# EAGLE design Polsador  (EAGLE 6.4)
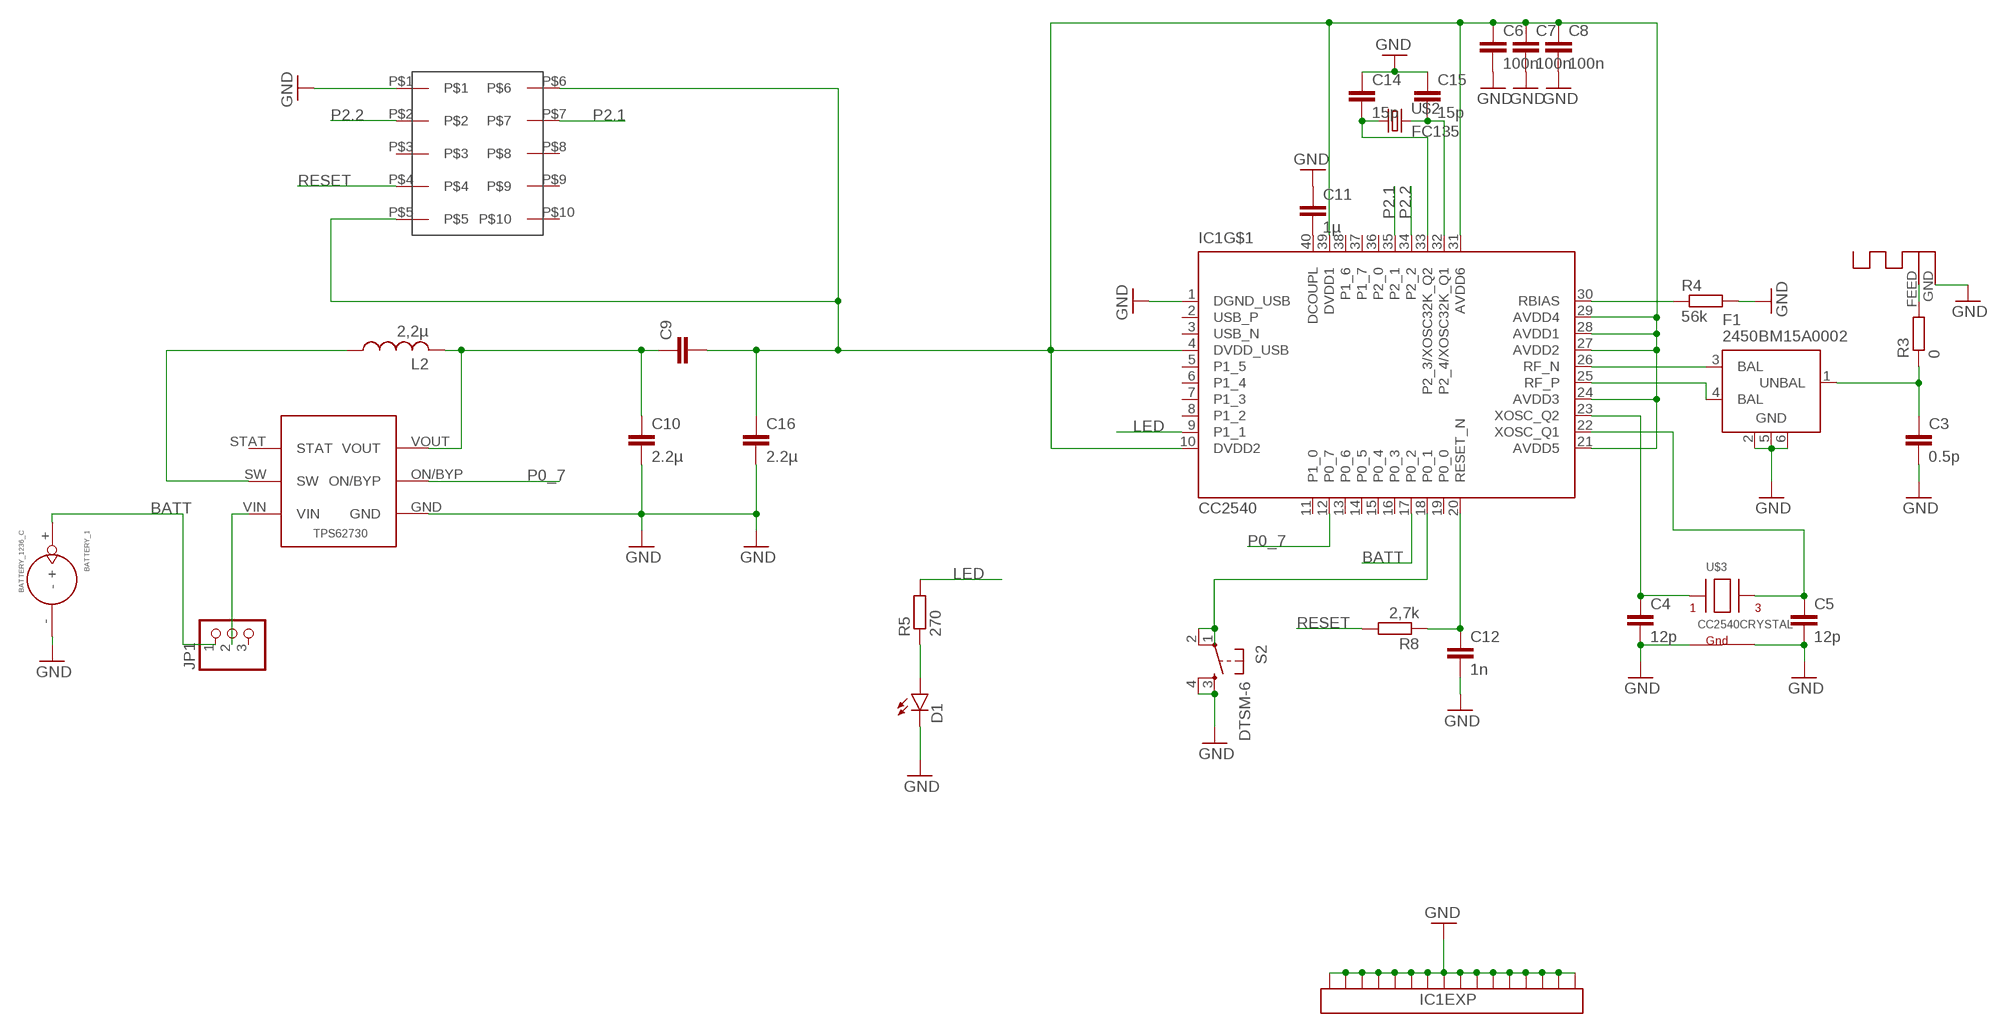
[diagram p0: schematic, sheet 1]

## Parts
ANT1  ANTENNA  [RN-ANT]
BATTERY_1  BATTERY_1236_C  [BATTERY_1236_C]
C3  0.5p  C-EUC0402K  [C0402K]
C4  12p  C-EUC0402K  [C0402K]
C5  12p  C-EUC0402K  [C0402K]
C6  100n  C-EUC0402K  [C0402K]
C7  100n  C-EUC0402K  [C0402K]
C8  100n  C-EUC0402K  [C0402K]
C9  C-EUC0402  [C0402]
C10  2.2µ  C-EUC0402K  [C0402K]
C11  1µ  C-EUC0402K  [C0402K]
C12  1n  C-EUC0402K  [C0402K]
C14  15p  C-EUC0402K  [C0402K]
C15  15p  C-EUC0402K  [C0402K]
C16  2.2µ  C-EUC0402K  [C0402K]
D1  LED0603  [LED-0603]
F1  2450BM15A0002  [2450BM15A0002]
IC1  CC2540  [QFN40-6X6]
JP1  PINHD-1X3  [1X03]
L2  2,2µ  L-USL2012C  [L2012C]
R3  0  R-EU_R0402  [R0402]
R4  56k  R-EU_R0402  [R0402]
R5  270  R-EU_R0402  [R0402]
R8  2,7k  R-EU_R0402  [R0402]
S2  DTSM-6  [DTSM-6]
U$1  DEBUG  [DEBUG]
U$2  FC135  [FC135]
U$3  CC2540CRYSTAL  [CC2540CRYSTAL]
U$4  TPS62730  [TPS62730]

## Nets
BATT: BATTERY_1.+ IC1.17(P0_2) JP1.1
GND: ANT1.GND BATTERY_1.- C3.2 C4.2 C5.2 C6.2 C7.2 C8.2 C10.2 C11.1 C12.2 C14.1 C15.1 C16.2 D1.C F1.2(GND) F1.5(GND) F1.6(GND) IC1.1(DGND_USB) IC1.EXP@1(EXP:EXP16) IC1.EXP@2(EXP:EXP16) IC1.EXP@3(EXP:EXP16) IC1.EXP@4(EXP:EXP16) IC1.EXP@5(EXP:EXP16) IC1.EXP@6(EXP:EXP16) IC1.EXP@7(EXP:EXP16) IC1.EXP@8(EXP:EXP16) IC1.EXP@9(EXP:EXP16) IC1.EXP@10(EXP:EXP16) IC1.EXP@11(EXP:EXP16) IC1.EXP@12(EXP:EXP16) IC1.EXP@13(EXP:EXP16) IC1.EXP@14(EXP:EXP16) IC1.EXP@15(EXP:EXP16) IC1.EXP@16(EXP:EXP16) R4.2 S2.3 S2.4 U$1.P$1 U$3.2(G1) U$3.4(G2) U$4.GND
LED: IC1.9(P1_1) R5.2
N$1: C14.2 IC1.33(P2_3/XOSC32K_Q2) U$2.1
N$2: C15.2 IC1.32(P2_4/XOSC32K_Q1) U$2.2
N$3: IC1.18(P0_1) S2.1 S2.2
N$5: L2.1 U$4.SW
N$6: C9.1 C10.1 L2.2 U$4.VOUT
N$7: C4.1 IC1.23(XOSC_Q2) U$3.1(X1)
N$8: F1.3(BAL) IC1.26(RF_N)
N$9: F1.4(BAL) IC1.25(RF_P)
N$10: C3.1 F1.1(UNBAL) R3.1
N$11: ANT1.FEED R3.2
N$12: C5.1 IC1.22(XOSC_Q1) U$3.3(X2)
N$13: IC1.30(RBIAS) R4.1
N$14: C11.2 IC1.40(DCOUPL)
N$15: C12.1 IC1.20(RESET_N) R8.1
N$16: C6.1 C7.1 C8.1 C9.2 C16.1 IC1.4(DVDD_USB) IC1.10(DVDD2) IC1.21(AVDD5) IC1.24(AVDD3) IC1.27(AVDD2) IC1.28(AVDD1) IC1.29(AVDD4) IC1.31(AVDD6) IC1.39(DVDD1) U$1.P$5 U$1.P$6
N$17: JP1.2 U$4.VIN
N$18: D1.A R5.1
P0_7: IC1.12(P0_7) U$4.ON/BYP
P2.1: IC1.35(P2_1) U$1.P$7
P2.2: IC1.34(P2_2) U$1.P$2
RESET: R8.2 U$1.P$4
Unconnected: IC1.2(USB_P) IC1.3(USB_N) IC1.5(P1_5) IC1.6(P1_4) IC1.7(P1_3) IC1.8(P1_2) IC1.11(P1_0) IC1.13(P0_6) IC1.14(P0_5) IC1.15(P0_4) IC1.16(P0_3) IC1.19(P0_0) IC1.36(P2_0) IC1.37(P1_7) IC1.38(P1_6) JP1.3 U$1.P$3 U$1.P$8 U$1.P$9 U$1.P$10 U$4.STAT

## Library data of the parts
ANT1 = adafruit:ANTENNA
BATTERY_1 = Itead_BP_110825.lbr:BATTERY_1236_C: SOC004
C3-C12 C14-C16 = rcl:C-EU: CAPACITOR, European symbol
D1 = SparkFun-LED:LED: LEDs Standard schematic elements and footprints for 5mm, 3mm, 1206, and 0603 sized LEDs. 5mm - Spark Fun Electronics SKU : COM-00529 (and others)
F1 = johanson-technology:2450BM15A0002: 2.45 GHz Impedance Matched Balun-Filter For TI CC253X/CC2540 Chipset family Data sheet <http://www.johansontechnology.com/images/stories/ip/baluns/balun_filter_combo_matched_2450bm15a0002_v8.pdf>
IC1 = texas:CC2540: 2.4-GHz Bluetooth® low energy System-on-Chip Auto generated by make-symbol-device-package-bsdl.ulp Rev. 39 Source: cc2540.txt
JP1 = pinhead:PINHD-1X3: PIN HEADER
L2 = rcl:L-US: INDUCTOR, American symbol
R3-R5 R8 = rcl:R-EU_: RESISTOR, European symbol
S2 = switch-tact:DTSM-6
U$1 = untitled:DEBUG
U$2 = crysta1l:FC135
U$3 = adafruit:CC2540CRYSTAL
U$4 = TI-TPS6273X:TPS62730: TPS62730: Step Down Converter with Bypass Mode for Ultra Low Power Wireless Applications The TPS62730 is a high frequency synchronous step down DC-DC converter optimized for ultra low power wireless applications. The device is optimized to supply TI&3146;s Low Power Wireless sub 1GHz and 2.4GHz RF transceivers and System-On-Chip-solutions. The TPS62730 reduces the current consumption drawn from the battery during TX and RX mode by a high efficient step down voltage conversion. It provides up to 100mA output current and allows the use of tiny and low cost chip inductors and capacitors. With an input voltage range of 1.9V to 3.9V the device supports Li-primary battery chemistries such as Li-SOCl2, Li-SO2, Li-MnO2 and also two cell alkaline batteries. The TPS62730 features an Ultra Low Power bypass mode with typical 30nA current consumption to support sleep and low power modes of TI’s CC2540 Low Energy and CC430 System-On-Chip solutions. In this bypass mode, the output capacitor of the DC/DC converter is connected via an integrated typ. 2.1Ω Bypass switch to the battery. In DC/DC operation mode the device provides a fixed output voltage to the system. With a switch frequency up to 3MHz, the TPS62730 features low output ripple voltage and low noise even with a small 2.2µF output capacitor. The automatic transition into bypass mode during DC/DC operation prevents an increase of output ripple voltage and noise once the DC/DC converter operates close to 100% duty cycle. The device automatically enters bypass mode once the battery voltage falls below the transition threshold VIT BYP. The TPS62730 is available in a 1 × 1.5mm2 6 pin QFN package.

## Board
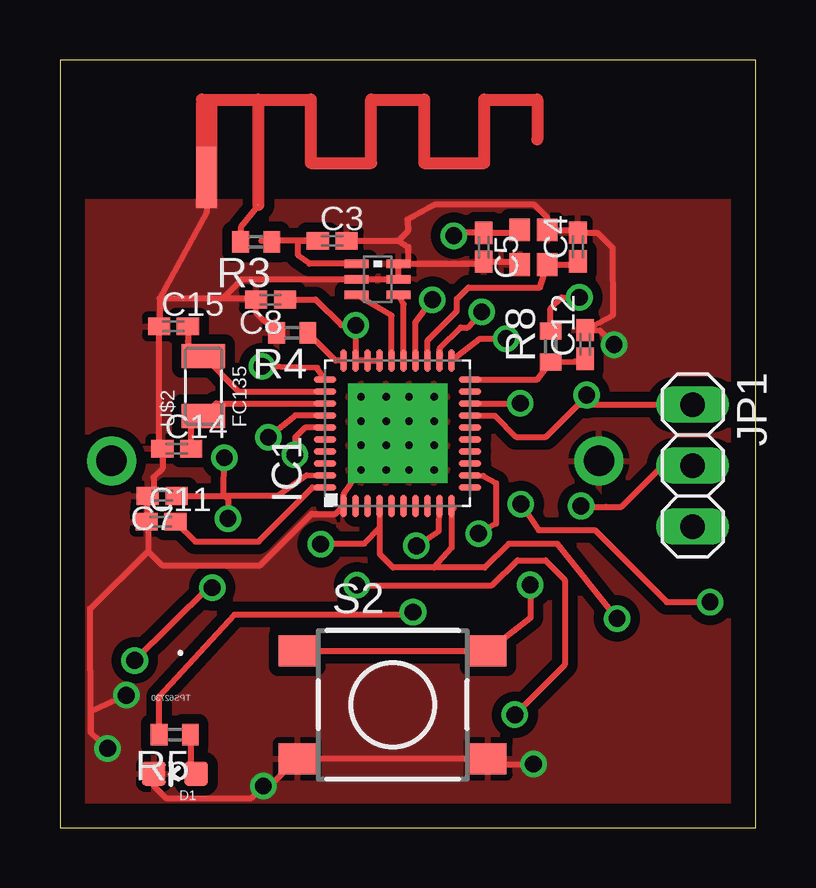
[diagram p1: board, top side]
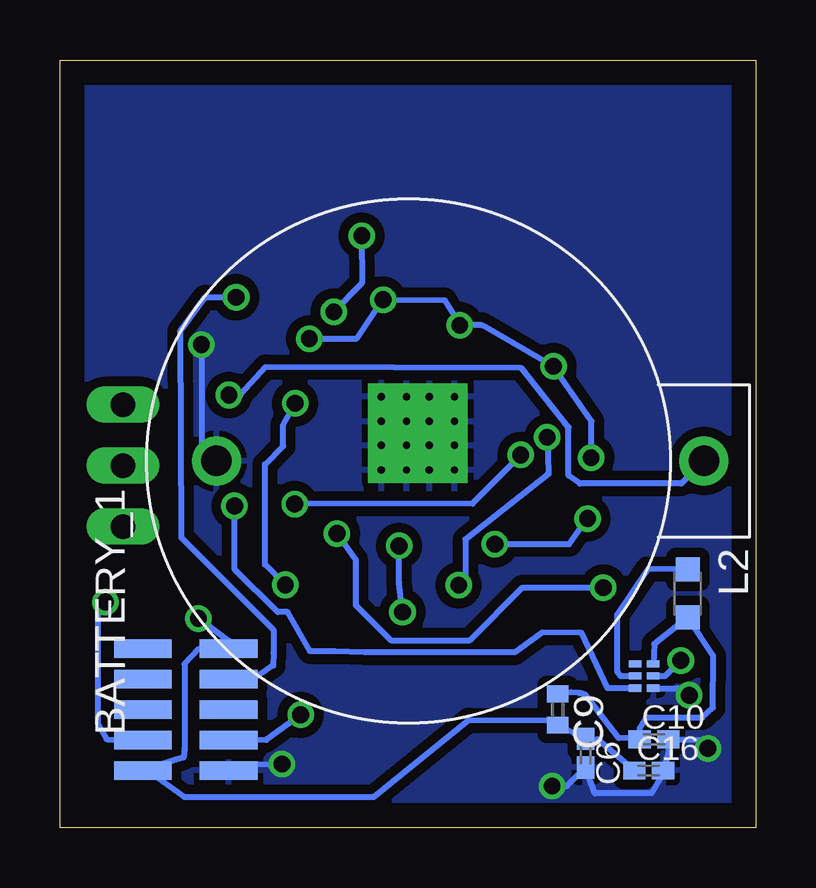
[diagram p2: board, bottom side, seen from below]

Size 29 x 32 mm. Coordinates in mm from the lower left corner, seen from the top.
Outline: 0,0 29,0 29,32 0,32 0,0
Copper layers (1*16): Top 0.035mm / dielectric 1.5mm / Bottom 0.035mm
Design rules "default": minimum track width 10mil, minimum drill 24mil, track to track 8mil, track to pad 8mil, pad to pad 8mil, via to via 8mil, smd to smd 8mil, copper to edge 40mil, drill to drill 8mil, minimum pad ring 10mil, minimum via ring 8mil, stop-mask expansion 4mil, vias tented up to drill 0mil, thermal gap 10mil

### Footprints (pad centres in the part's own frame; a part is rotated, then mirrored left to right if it is on the bottom)
RN-ANT = smd 0.025 x 0.025: FEED 0,2.159 | smd 2.54 x 0.889: GND -1.143,0
BATTERY_1236_C = drill 1.27 pad 2.032: + 0,0; - 0,20.32
C0402K = smd 0.925 x 0.74: 1 -0.6,0; 2 0.6,0
C0402 = smd 0.7 x 0.9: 1 -0.65,0; 2 0.65,0
LED-0603 = smd 1 x 1: A 0,-0.877; C 0,0.877
2450BM15A0002 = smd 0.35 x 1: 1 -0.65,-0.875; 2 0,-0.875; 3 0.65,-0.875; 4 0.65,0.875; 5 0,0.875; 6 -0.65,0.875
QFN40-6X6 = smd 0.95 x 0.28: 1 -3.025,2.25; 2 -3.025,1.75; 3 -3.025,1.25; 4 -3.025,0.75; 5 -3.025,0.25; 6 -3.025,-0.25; 7 -3.025,-0.75; 8 -3.025,-1.25; 9 -3.025,-1.75; 10 -3.025,-2.25; 21 3.025,-2.25; 22 3.025,-1.75; 23 3.025,-1.25; 24 3.025,-0.75; 25 3.025,-0.25; 26 3.025,0.25; 27 3.025,0.75; 28 3.025,1.25; 29 3.025,1.75; 30 3.025,2.25 | smd 0.28 x 0.95: 11 -2.25,-3.025; 12 -1.75,-3.025; 13 -1.25,-3.025; 14 -0.75,-3.025; 15 -0.25,-3.025; 16 0.25,-3.025; 17 0.75,-3.025; 18 1.25,-3.025; 19 1.75,-3.025; 20 2.25,-3.025; 31 2.25,3.025; 32 1.75,3.025; 33 1.25,3.025; 34 0.75,3.025; 35 0.25,3.025; 36 -0.25,3.025; 37 -0.75,3.025; 38 -1.25,3.025; 39 -1.75,3.025; 40 -2.25,3.025 | drill 0.3 pad 1.1 square: EXP@1 -1.525,1.525; EXP@2 -0.5,1.525; EXP@3 0.5,1.525; EXP@4 1.525,1.525; EXP@5 -1.525,0.475; EXP@6 -0.5,0.475; EXP@7 0.5,0.475; EXP@8 1.525,0.475; EXP@9 -1.525,-0.475; EXP@10 -0.5,-0.475; EXP@11 0.5,-0.475; EXP@12 1.525,-0.475; EXP@13 -1.525,-1.525; EXP@14 -0.5,-1.525; EXP@15 0.5,-1.525; EXP@16 1.525,-1.525
1X03 = drill 1.016 long: 1 -2.54,0; 2 0,0; 3 2.54,0
L2012C = smd 1 x 1: 1 -1,0; 2 1,0
R0402 = smd 0.7 x 0.9: 1 -0.65,0; 2 0.65,0
DTSM-6 = smd 1.55 x 1.3: 1 -3.975,2.25; 2 3.975,2.25; 3 -3.975,-2.25; 4 3.975,-2.25
DEBUG = smd 2.4 x 0.76: P$1 -2.54,3.81; P$2 -2.54,2.54; P$3 -2.54,1.27; P$4 -2.54,0; P$5 -2.54,-1.27; P$6 1.04,3.81; P$7 1.04,2.54; P$8 1.04,1.27; P$9 1.04,0; P$10 1.04,-1.27
FC135 = smd 1 x 1.8: 1 -1.25,0; 2 1.25,0
CC2540CRYSTAL = smd 0.95 x 0.85: 1 0,0; 2 1.45,0; 3 1.45,1.15; 4 0,1.15
TPS62730 = smd 0.52 x 0.3: GND 0.584,-0.838; ON/BYP 0.584,-0.33; STAT -0.178,0.178; SW -0.178,-0.33; VIN -0.178,-0.838; VOUT 0.584,0.178

### Placement (x,y rotation side)
ANT1  6.11,25.95 270 top
BATTERY_1  2.15,15.28 90 bottom
C3  11.35,24.46 0 top
C4  21.59,24.2 90 top
C5  17.67,24.2 270 top
C6  7.09,3.1 270 bottom
C7  4.26,13.83 180 top
C8  8.78,22.01 180 top
C9  8.25,4.92 270 bottom
C10  4.24,3.68 0 bottom
C11  4.21,12.75 0 top
C12  21.9,20.14 90 top
C14  4.87,15.79 0 top
C15  4.74,20.89 0 top
C16  4.45,2.38 0 bottom
D1  4.8,2.25 90 top
F1  13.25,22.86 270 top
IC1  14.08,16.44 90 top
JP1  26.38,15.09 270 top
L2  2.83,9.75 270 bottom
R3  8.18,24.42 180 top
R4  9.68,20.63 180 top
R5  4.79,3.87 180 top
R8  20.45,20.05 90 top
S2  13.87,5.12 0 top
U$1  24.51,6.19 180 bottom
U$2  5.98,18.4 90 top
U$3  20.32,23.46 90 top
U$4  4.85,6.65 0 bottom

### Tracks (layer width: path | path; a pad name or v marks a point on that pad's centre or on a via)
BATT  (via drill 0.7)
  Top 0.254: IC1.17 17.12,17.17 18.13,17.17 19.02,16.29 20.26,16.29 21.6,17.63 21.91,17.63 | 21.91,17.63 JP1.1 | v21.96,18.03 21.95,17.75 21.91,17.63
  Bottom 0.254: v21.96,18.03 21.49,18.03 20.44,19.19 9.75,19.15 7.79,16.68 7.8,14.67 7.33,14.34 3.1,14.34 BATTERY_1.+
GND  (via drill 0.7)
  Top 0.254: F1.6 F1.5 F1.2 7.58,22.85 6.79,22.06 | F1.6 17.58,23.51 C5.2 19.04,23.59 U$3.4 | C3.2 14.12,24.46 | 14.12,24.46 14.52,24.2 14.52,23.52 F1.6 | 14.12,24.46 14.5,24.86 14.49,25.35 15.61,25.96 19.77,25.96 20.32,25.42 U$3.2 21.48,24.91 C4.2 21.62,24.77 22.44,24.77 23.05,24.16 23.06,21.37 C12.2 22.51,20.73 v23.1,20.13 | IC1.EXP@8 IC1.EXP@4 IC1.EXP@3 IC1.EXP@2 IC1.EXP@1 | IC1.EXP@8 IC1.EXP@12 IC1.EXP@16 IC1.EXP@15 IC1.EXP@14 IC1.EXP@13 | IC1.EXP@8 IC1.EXP@7 | IC1.EXP@7 IC1.EXP@11 | IC1.EXP@7 IC1.EXP@6 | IC1.EXP@6 IC1.EXP@10 | IC1.EXP@6 IC1.EXP@5 IC1.EXP@9 | IC1.EXP@1 12.55,14.84 | R4.2 8.18,21.48 C8.2 8.13,22.06 6.79,22.06 | 6.79,22.06 4.15,22.06 | 4.15,22.06 4.16,21.42 C15.1 4.14,15.93 C14.1 4.27,14.98 3.9,14.61 3.9,14.07 C7.2 3.66,12.8 C11.1 3.68,12.68 3.68,11.52 | ANT1.GND 6.11,25.64 4.15,22.06 | v19.74,2.64 18.53,2.64 S2.4 S2.3 8.76,1.73 v8.48,1.73 7.97,1.22 4.42,1.22 3.92,1.73 D1.C | 3.68,11.52 4.26,10.94 8.35,10.94 10.49,13.08 11.5,13.08 IC1.1 11.83,13.88 12.12,14.35 12.12,14.48 IC1.EXP@1 | v1.99,3.3 1.27,3.97 | 1.27,3.97 1.26,9.12 3.68,11.52 | v2.76,5.51 1.29,4.85 1.27,3.97
  Bottom 0.254: v19.74,2.64 21.97,2.61 U$1.P$1 | v8.48,1.73 7.86,1.73 C6.2 6.69,1.42 4.34,1.43 3.89,2.2 C16.2 3.63,3.12 C10.2 2.29,3.65 v1.99,3.3 | U$4.GND 3.21,5.81 v2.76,5.51 | v23.1,20.13 23.1,15.91 BATTERY_1.-
  pour Bottom (isolate 0.406): 0,32.04 29.26,32.04 29.26,-0.08 -0.08,-0.08 -0.08,31.87
  pour Top (isolate 0.406): 0,26.09 29.18,26.09 29.18,-0.17 -0.08,-0.17 -0.08,25.93
LED  (via drill 0.7)
  Top 0.254: R5.2 4.14,5.48 7.27,8.88 14.7,8.88 v14.72,8.98 | v14.86,11.74 15.8,12.37 IC1.9
  Bottom 0.254: v14.72,8.98 14.86,10.21 v14.86,11.74
N$1
  Top 0.254: C14.2 5.47,16.64 arc-90 U$2.1 6.52,17.68 IC1.33
N$2
  Top 0.254: C15.2 5.34,20.29 arc90 U$2.2 7.44,18.18 IC1.32
N$3  (via drill 0.7)
  Top 0.254: S2.1 S2.2 19.62,8.75 19.62,9.43 v19.61,10.11 | IC1.18 v19.19,17.68
  Bottom 0.254: v19.19,17.68 19.7,16.8 19.7,15.9 20.45,15.14 20.45,10.96 v19.61,10.11
N$5
  Bottom 0.254: L2.1 4.48,10.78 5.78,8.88 5.78,6.5 5.63,6.32 5.06,6.32 U$4.SW
N$6
  Bottom 0.254: U$4.VOUT 4.22,7.65 L2.2 1.77,7.16 1.77,5 2.21,4.58 4.52,4.6 4.83,4.14 C10.1 4.83,3.73 5.69,3.72 7.09,5.54 7.35,5.61 7.69,5.64 C9.1
N$7
  Top 0.254: C4.1 21.46,23.46 U$3.1 20.02,22.52 17.03,22.52 16.55,22.04 16.55,21.53 15.33,20.31 IC1.23
N$8
  Top 0.254: IC1.26 13.83,21.34 F1.3
N$9
  Top 0.254: IC1.25 14.33,21.82 F1.4
N$10
  Top 0.254: F1.1 10.4,23.51 9.94,23.85 9.94,24.47 C3.1 8.4,24.46 R3.1
N$11
  Top 0.254: R3.2 7.55,25.04 ANT1.FEED
N$12  (via drill 0.7)
  Top 0.254: U$3.3 19.05,24.8 C5.1 16.49,24.8 v16.42,24.67 | IC1.22 15.84,19.78 15.83,19.96 16.72,20.85 17.01,20.85 v17.59,21.5
  Bottom 0.254: v16.42,24.67 16.42,22.7 v17.59,21.5
N$13
  Top 0.254: IC1.30 11.5,19.46 R4.1
N$14
  Top 0.254: IC1.40 10.52,14.19 8.28,11.93 5.64,11.93 C11.2
N$15
  Top 0.254: IC1.20 19.9,18.68 R8.1 21.48,19.43 C12.1
N$16  (via drill 0.7)
  Top 0.254: IC1.24 14.82,21.07 v15.53,22.01 | IC1.28 12.33,19.5 v12.33,20.94 11.73,20.94 10.65,22.02 C8.1 | IC1.28 IC1.29 | IC1.28 IC1.27 | IC1.21 17.51,20.38 v18.6,20.38 | IC1.31 10.72,19.16 v8.42,19.23 | C7.1 6.83,13.82 | IC1.39 10.29,14.7 9.06,13.83 6.83,13.82 | 16.42,13.31 IC1.10 16.33,11.66 15.6,10.83 | 15.6,10.83 13.89,10.83 13.33,11.4 IC1.4 | 13.34,11.56 13.34,13.28 IC1.4 | 6.83,13.82 v6.85,15.42 | v23.23,8.72 20.73,11.83 18.7,11.83 17.71,10.83 15.6,10.83 | IC1.4 13.33,12.48 12.68,11.83 10.79,11.83 v10.87,11.81 | v7,12.88 7.02,13.69 6.83,13.82
  Bottom 0.254: v18.6,20.38 16.62,20.39 v15.53,22.01 12.96,21.99 v12.33,20.94 11.41,20.94 v8.42,19.23 6.84,16.94 v6.85,15.42 | C16.1 6.58,3.68 C6.1 7.56,3.92 C9.2 8.52,4.44 11.97,4.46 15.93,1.26 23.8,1.26 25.64,2.57 U$1.P$6 23.85,2.93 23.8,3.29 23.8,6.81 23.21,7.44 21.81,7.44 U$1.P$5 21.96,7.79 v23.23,8.72 | v10.87,11.81 7.77,11.81 v7,12.88
N$17  (via drill 0.7)
  Top 0.254: JP1.2 25.88,15.08 25.12,15.08 23.41,13.37 22.77,13.37 22.19,13.36 v21.72,13.41
  Bottom 0.254: U$4.VIN 6.17,5.81 7.27,8.12 8.89,8.13 10.04,7.31 16.32,7.31 17.55,7.35 18.58,7.35 19.5,8.99 19.92,8.98 21.71,10.76 v21.72,13.41
N$18
  Top 0.254: R5.1 5.44,2.48 D1.A
P0_7  (via drill 0.7)
  Top 0.254: IC1.12 17.11,14.7 17.64,14.66 18.18,14.36 18.18,12.9 18.19,12.67 v17.45,12.26 | v3.12,6.96 6.2,10 v6.35,10
  Bottom 0.254: U$4.ON/BYP 3.76,6.32 v3.12,6.96 | v17.45,12.26 16.67,11.17 16.67,9.28 15.2,7.81 11.91,7.81 9.72,10 v6.35,10
P2.1  (via drill 0.7)
  Top 0.254: IC1.35 11.04,16.67 10.21,16.67 9.81,16.27 v9.79,15.54 | v19.21,13.48 19.96,12.41 22.29,12.41 25.3,9.4 v27.11,9.4
  Bottom 0.254: v9.79,15.54 11.8,13.51 v19.21,13.48 | v27.11,9.4 27.42,9.09 27.42,4.32 27.06,3.68 U$1.P$7
P2.2  (via drill 0.7)
  Top 0.254: IC1.34 9.82,17.18 v8.69,16.27 | v12.38,10.1 18.02,10.1 19.08,11.14 20.25,11.14 21.05,10.33 21.05,6.78 v18.97,4.7
  Bottom 0.254: v8.69,16.27 8.63,14.75 12.1,12.01 12.1,10.38 v12.38,10.1 | v18.97,4.7 20.4,3.65 U$1.P$2
RESET  (via drill 0.7)
  Top 0.254: R8.2 20.45,21.64 20.92,22.1 v21.66,22.1
  Bottom 0.254: v21.66,22.1 22.96,22.1 23.99,20.69 23.94,12.08 20.1,8.24 20.1,7.26 20.1,6.75 20.92,6.2 U$1.P$4